# Altium project LM-003.PrjPcb (part 1 of 4)
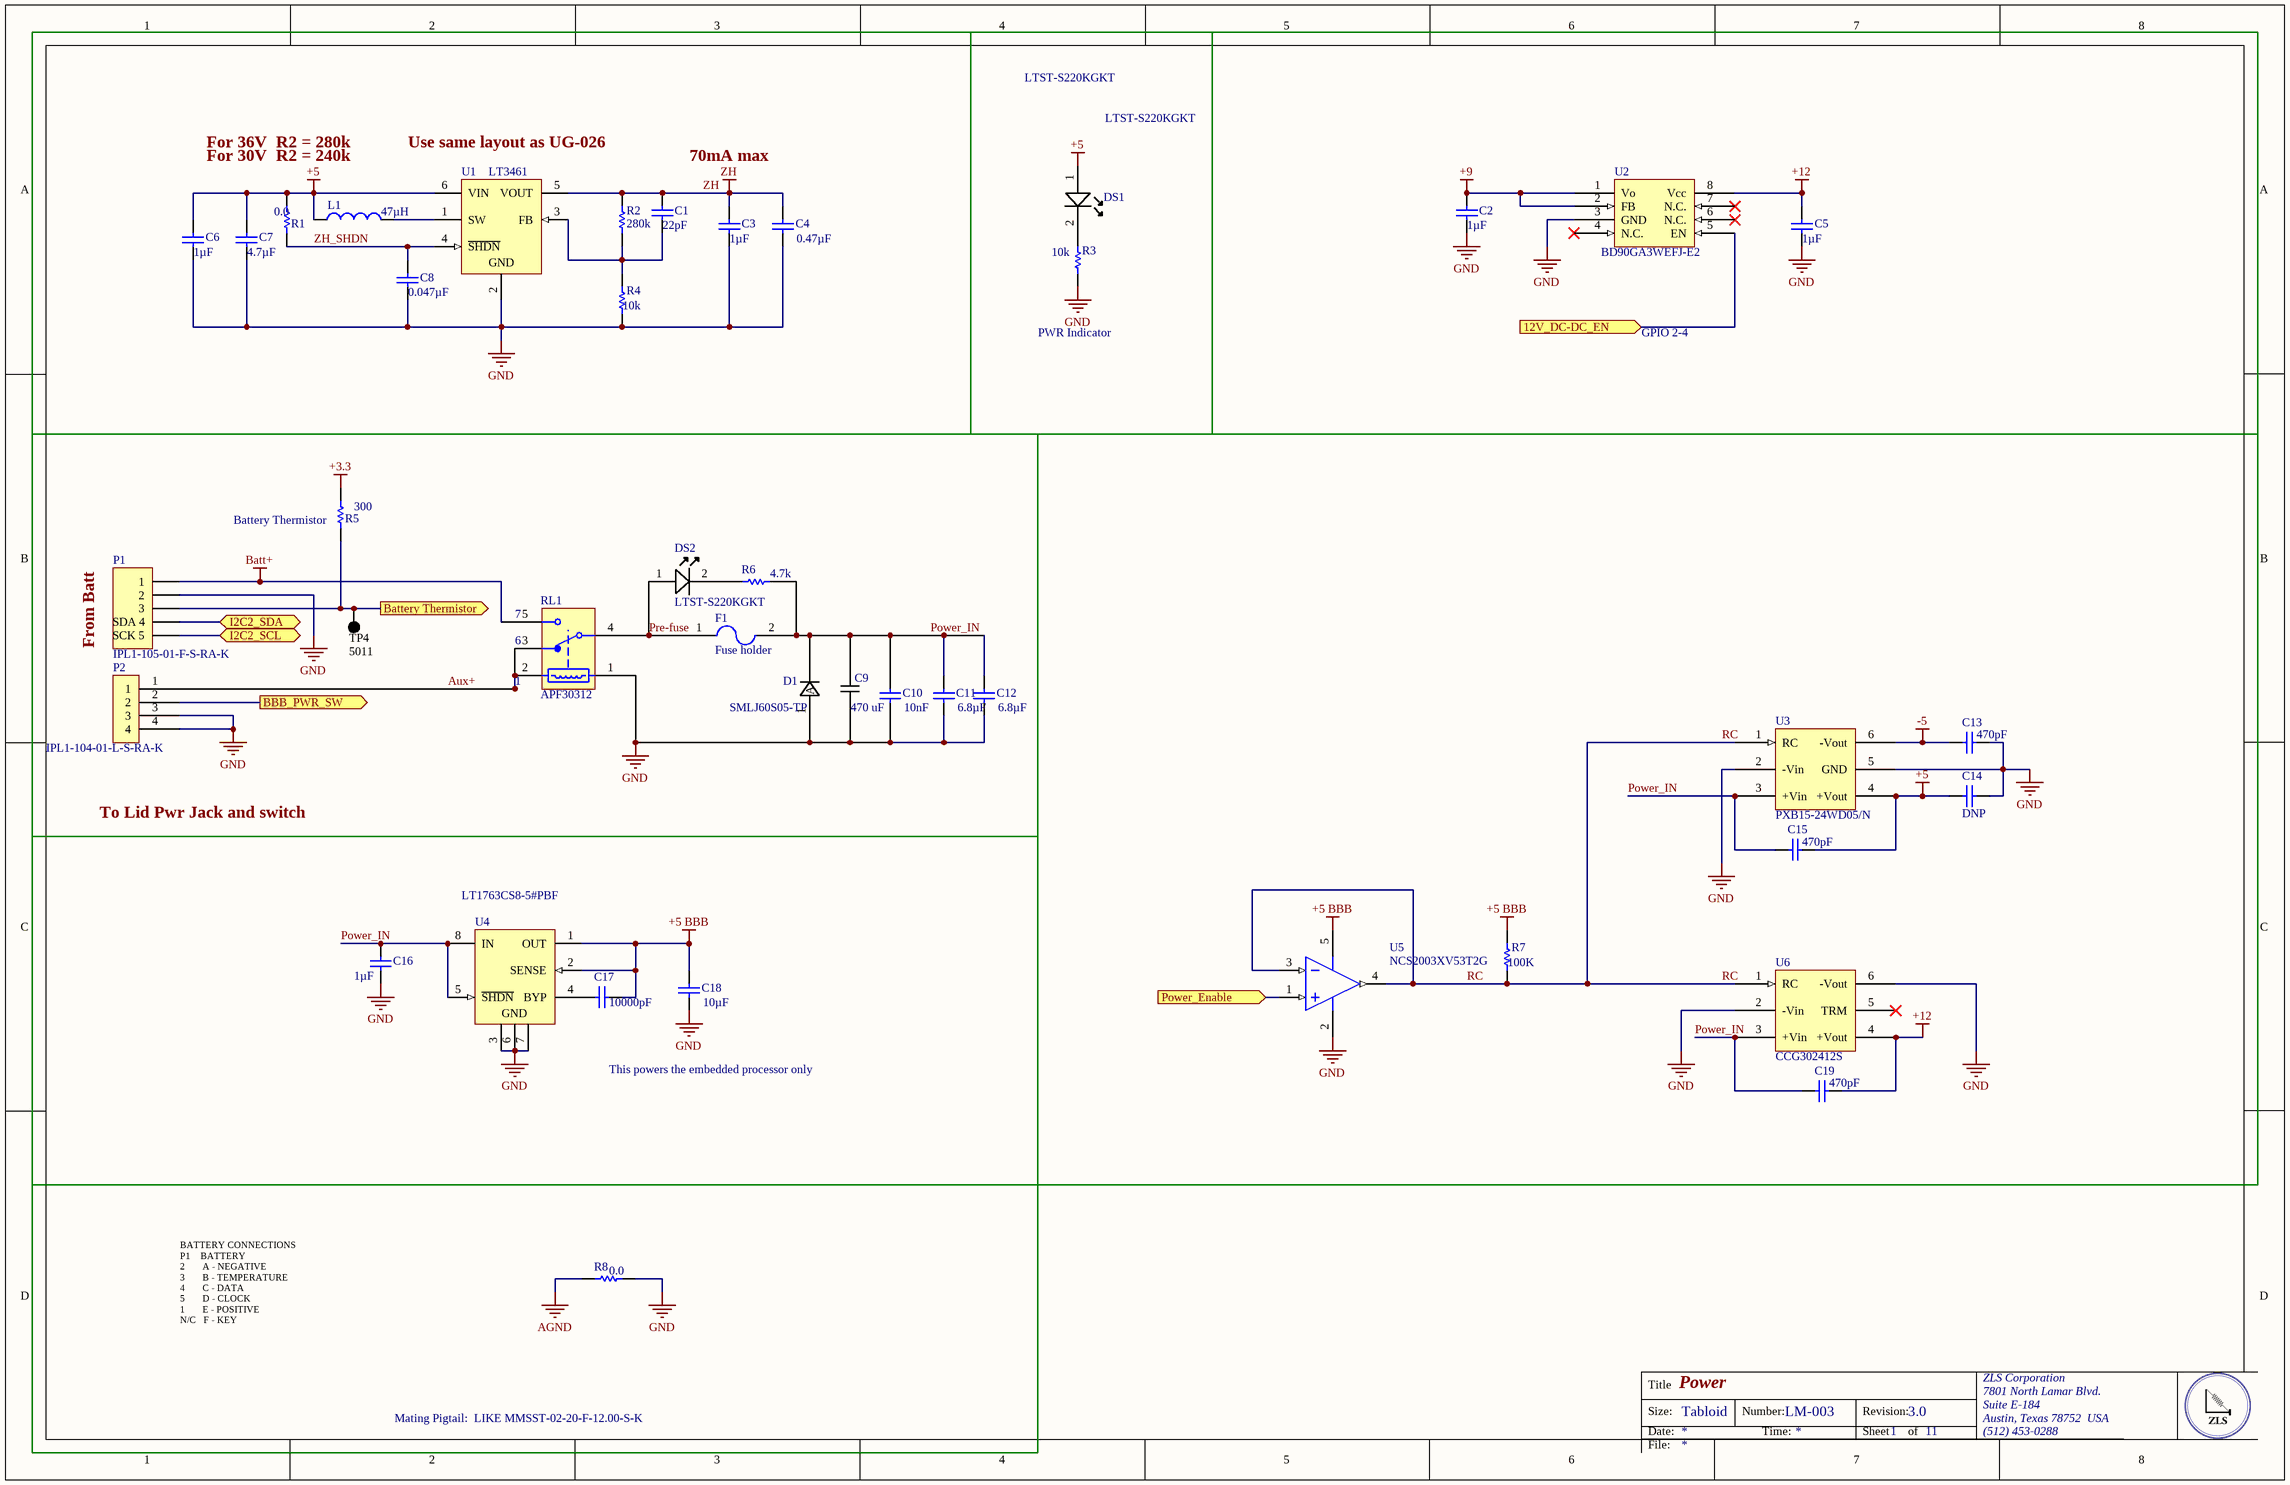
[diagram p0: Power.SchDoc]
9 sheets, 178 parts. Net scope: flat (ports and power ports of the same name join across sheets).
Board file: LM-003.PcbDoc
Sheets:
  Power.SchDoc
  FeedbackLoop.SchDoc
  ADC.SchDoc
  BBB Headers.SchDoc
  Connectors.SchDoc
  heater_control.SchDoc
  Power Monitor.SchDoc
  Real Time Clock.SchDoc
  RS232.SchDoc

## Sheet Power.SchDoc: Power
size Tabloid; DocumentNumber: LM-003; Revision: 3.0; SheetNumber: 1; SheetTotal: 11

### Parts
C1  Capacitance: 22pF  [CAPC0603(1608)100_N]  (hidden comment: CAP CER 22PF 50V X7R 0603)
C2  Capacitance: 1µF  [CAPC1206(3216)130_N]  (hidden comment: CAP CER 1UF 50V X7R 1210)
C3  Capacitance: 1µF  [CAPC1210(3225)100_N]  (hidden comment: CAP CER 1UF 50V X7R 1210)
C4  Capacitance: 0.47µF  [CAPC1206(3216)190_N]  (hidden comment: CAP CER 0.47UF 50V X7R 1206)
C5  Capacitance: 1µF  [CAPC1206(3216)130_N]  (hidden comment: CAP CER 1UF 50V X7R 1210)
C6  Capacitance: 1µF  [CAPC0805(2012)145_N]  (hidden comment: CAP CER 1UF 16V X7R 0805)
C7  Capacitance: 4.7µF  [CAPC1206(3216)130_N]  (hidden comment: CAP CER 4.7UF 16V X7R 1206)
C8  Capacitance: 0.047µF  [CAPC0805(2012)145_N]  (hidden comment: CAP CER 0.047UF 16V X7R 0603)
C9  Capacitance: 470 uF  [RAD-0.1]  (hidden comment: Aluminum Electrolytic Capacitors - Leaded 16V 470uF 20%)
C10  Capacitance: 10nF  [CAPC0805(2012)145_N]  (hidden comment: CAP CER 10000PF 50V X7R 0805)
C11  Capacitance: 6.8µF  [CAPC1210(3225)100_L]  (hidden comment: CAP CER 6.8UF 50V X5R 1206)
C12  Capacitance: 6.8µF  [CAPC1210(3225)100_L]  (hidden comment: CAP CER 6.8UF 50V X5R 1206)
C13  Capacitance: 470pF  [CAPC1812(4532)230_M]  (hidden comment: CAP CER 470PF 3KV X7R 1812)
C14  DNP  [CAPC1812(4532)230_M]
C15  Capacitance: 470pF  [CAPC1812(4532)230_M]  (hidden comment: CAP CER 470PF 3KV X7R 1812)
C16  Capacitance: 1µF  [CAPC1210(3225)100_L]  (hidden comment: CAP CER 1UF 50V X7R 1210)
C17  Capacitance: 10000pF  [CAPC0805(2012)145_N]  (hidden comment: CAP CER 10000PF 25V X7R 0805)
C18  Capacitance: 10µF  [CAPC0805(2012)145_N]  (hidden comment: CAP CER 10UF 10V X7R 0805)
C19  Capacitance: 470pF  [CAPC1812(4532)230_M]  (hidden comment: CAP CER 470PF 3KV X7R 1812)
D1  Manufacturer Part Number: SMLJ60S05-TP  [DO-214AB]  (hidden comment: DIODE GEN PURP 50V 6A DO214AB)
DS1  Manufacturer Part Number: LTST-S220KGKT  [0805C_L]  (hidden comment: Lite-On LTST-S220KGKT Green LED, 571 nm 2012 (0805) Side View, Rectangle Lens SMD package)
DS2  Manufacturer Part Number: LTST-S220KGKT  [0805C_L]  (hidden comment: Lite-On LTST-S220KGKT Green LED, 571 nm 2012 (0805) Side View, Rectangle Lens SMD package)
F1  Fuse holder  [01530007Z]
L1  Inductance: 47µH  [0402-A]  (hidden comment: FIXED IND 47UH 170MA 1.3 OHM SMD)
P1  IPL1-105-01-F-S-RA-K  [IPL1-105-1]
P2  IPL1-104-01-L-S-RA-K  [IPL1-104-01]
R1  Resistance (Ohms): 0.0  [RESC0805(2012)_M]  (hidden comment: RES SMD 0.0 OHM JUMPER 1/8W 0805)
R2  Resistance (Ohms): 280k  [RESC0805(2012)_M]  (hidden comment: RES SMD 280K OHM 1% 1/8W 0805)
R3  Resistance (Ohms): 10k  [RESC0805(2012)_M]  (hidden comment: RES SMD 10K OHM 1% 1/8W 0805)
R4  Resistance (Ohms): 10k  [RESC0805(2012)_M]  (hidden comment: RES SMD 10K OHM 1% 1/8W 0805)
R5  Resistance (Ohms): 300  [RESC0805(2012)_M]  (hidden comment: 300K 5% 0805(2012))
R6  Resistance (Ohms): 4.7k  [RESC0805(2012)_M]  (hidden comment: RES SMD 4.7K OHM 1% 1/8W 0805)
R7  Resistance: 100K  [RESC0805(2012)_M]  (hidden comment: RES SMD 100K OHM 1% 1/8W 0805)
R8  Resistance (Ohms): 0.0  [RESC0805(2012)_M]  (hidden comment: RES SMD 0.0 OHM JUMPER 1/8W 0805)
RL1  APF30312  [PNSC-PF-5-2800x500x1500_V]
TP4  5011  [KSTN-5011_V]
U1  LT3461  [LT-S6-6-TSOT-23_N]
U2  BD90GA3WEFJ-E2  [TSOP127P600X100-8N]
U3  PXB15-24WD05/N  [PXB15-24WD05/N]
U4  LT1763CS8-5#PBF  [LT-S8-8_M]
U5  NCS2003XV53T2G  [ONSC-SOT-553-5-463B_V]
U6  CCG302412S  [CCG30]

### Blocks framed on the sheet
GPIO 2-4: C2 C5 U2
From Batt: C9-C12 D1 DS2 F1 P1 P2 R5 R6 RL1 TP4
To Lid Pwr Jack and switch: C16-C18 U4
Mating Pigtail:  LIKE MMSST-02-20-F-12.00-S-K: R8

### Ports
12V_DC-DC_EN (in), Battery Thermistor (out), BBB_PWR_SW (out), I2C2_SCL, I2C2_SDA, Power_Enable (in)

### Nets
+3.3: R5.2
+5: C6.2 C7.2 C14.1 C15.2 DS1.1(A) L1.1 R1.1 U1.6(VIN) U3.4(+Vout)
+5 BBB: C17.1 C18.2 R7.1 U4.1(OUT) U4.2(SENSE) U5.5(VDD)
+9: C2.2 U2.1(Vo) U2.2(FB)
+12: C5.2 C19.2 U2.8(Vcc) U6.4(+Vout)
-5: C13.1 U3.6(-Vout)
AGND: R8.2
Batt+: P1.1 RL1.5(NO)
GND: C2.1 C3.1 C4.1 C5.1 C6.1 C7.1 C8.1 C9.2 C10.1 C11.1 C12.1 C13.2 C14.2 C16.1 C18.1 D1.1(A) P1.2 P2.3 P2.4 R3.1 R4.2 R8.1 RL1.1 U1.2(GND) U2.3(GND) U3.2(-Vin) U3.5(GND) U4.3(GND) U4.6(GND) U4.7(GND) U5.2(VSS) U6.2(-Vin) U6.6(-Vout)
ZH: C1.2 C3.2 C4.2 R2.1 U1.5(VOUT)
Aux+: P2.1 RL1.2 RL1.3(NC)
Power_IN: C9.1 C10.2 C11.2 C12.2 C15.1 C16.2 C19.1 D1.2(K) F1.2 R6.1 U3.3(+Vin) U4.5(~{SHDN}) U4.8(IN) U6.3(+Vin)
Pre-fuse: DS2.1(A) F1.1 RL1.4(COM)
RC: R7.2 U3.1(RC) U5.3(IN-) U5.4(OUT) U6.1(RC)
ZH_SHDN: C8.2 R1.2 U1.4(~{SHDN})
NetC1_1: C1.1 R2.2 R4.1 U1.3(FB)
NetC17_2: C17.2 U4.4(BYP)
NetDS1_2: DS1.2(K) R3.2
NetDS2_2: DS2.2(K) R6.2
NetL1_2: L1.2 U1.1(SW)
NetP1_3: P1.3 R5.1 TP4.1 ; port Battery Thermistor
NetP1_4: P1.4(SDA_4) ; port I2C2_SDA
NetP1_5: P1.5(SCK_5) ; port I2C2_SCL
NetP2_2: P2.2 ; port BBB_PWR_SW
NetU2_5: U2.5(EN) ; port 12V_DC-DC_EN
NetU5_1: U5.1(IN+) ; port Power_Enable

Not connected (* = marked no-connect by the designer): U2 4(N.C.)* 6(N.C.)* 7(N.C.)*; U6 5(TRM)*

### Notes on the sheet
- LTST-S220KGKT
- For 36V  R2 = 280k
- For 30V  R2 = 240k
- Use same layout as UG-026
- 70mA max
- PWR Indicator
- (near R5) Battery Thermistor
- (near RL1) 7
- (near RL1) 3
- (near RL1) 6
- (near RL1) 1
- (near RL1) 8
- This powers the embedded processor only
- BATTERY CONNECTIONS
  P1    BATTERY
  2       A - NEGATIVE
  3       B - TEMPERATURE
  4       C - DATA
  5       D - CLOCK
  1       E - POSITIVE
  N/C   F - KEY
- Title
- Size:
- Date:
- Tabloid
- Number:
- Time:
- Revision:
- Sheet
- of
- ZLS Corporation
- 7801 North Lamar Blvd.
- Suite E-184
- Austin, Texas 78752  USA
- (512) 453-0288
- File:

### Library data of the parts
C1 = CMP-1035-00578-1: Manufacturer: AVX Corporation; Manufacturer Part Number: 06035C220JAT2A; Tolerance: ±5%; Supplier 1: Digi-Key; Supplier Part Number 1: 478-6204-6-ND; RoHS: RoHS Compliant; Category: Capacitors; Stock 1: 72942; Pricing 1: 1=0.2, 10=0.136, 100=0.0688, 1000=0.04166 (USD); Packaging: Digi-Reel®; Part Status: Active; Voltage - Rated: 50V; Temperature Coefficient: X7R; Operating Temperature: -55°C ~ 125°C; Features: -; Ratings: -; Applications: General Purpose; Mounting Type: Surface Mount, MLCC; Package / Case: 0603 (1608 Metric); Size / Dimension: 0.063" L x 0.032" W (1.60mm x 0.81mm); Height - Seated (Max): -; Thickness (Max): 0.035" (0.90mm); Lead Spacing: -; Lead Style: -; ComponentLink1URL: http://datasheets.avx.com/X7RDielectric.pdf; ComponentLink1Description: http://datasheets.avx.com/X7RDielectric.pdf
C2 C5 = CMP-1037-04913-1: Manufacturer: Murata Electronics North America; Manufacturer Part Number: GRM32RR71H105KA01L; Tolerance: ±10%; Supplier 1: Digi-Key; Supplier Part Number 1: 490-1863-6-ND; RoHS: RoHS Compliant; Category: Capacitors; Stock 1: 66890; Pricing 1: 1=0.35, 10=0.242, 100=0.1449, 500=0.10868 (USD); Packaging: Digi-Reel®; Part Status: Active; Voltage - Rated: 50V; Temperature Coefficient: X7R; Operating Temperature: -55°C ~ 125°C; Features: -; Ratings: -; Applications: General Purpose; Mounting Type: Surface Mount, MLCC; Package / Case: 1210 (3225 Metric); Size / Dimension: 0.126" L x 0.098" W (3.20mm x 2.50mm); Height - Seated (Max): -; Thickness (Max): 0.079" (2.00mm); Lead Spacing: -; Lead Style: -; ComponentLink1URL: http://search.murata.co.jp/Ceramy/image/img/A01X/G101/ENG/GRM32RR71H105KA01-01.pdf; ComponentLink1Description: http://search.murata.co.jp/Ceramy/image/img/A01X/G101/ENG/GRM32RR71H105KA01-01.pdf
C3 = CMP-1038-01123-1: Manufacturer: Taiyo Yuden; Manufacturer Part Number: UMK325B7105KH-T; Tolerance: ±10%; Supplier 1: Digi-Key; Supplier Part Number 1: 587-1366-1-ND; RoHS: RoHS Compliant; Category: Capacitors; Stock 1: 23864; Pricing 1: 1=0.36, 10=0.247, 100=0.1398, 500=0.0987, 1000=0.08637 (USD); Packaging: Cut Tape (CT); Part Status: Active; Voltage - Rated: 50V; Temperature Coefficient: X7R; Operating Temperature: -55°C ~ 125°C; Features: -; Ratings: -; Applications: General Purpose; Mounting Type: Surface Mount, MLCC; Package / Case: 1210 (3225 Metric); Size / Dimension: 0.126" L x 0.098" W (3.20mm x 2.50mm); Height - Seated (Max): -; Thickness (Max): 0.063" (1.60mm); Lead Spacing: -; Lead Style: -; ComponentLink1URL: http://www.yuden.co.jp/productdata/catalog/en/mlcc_all_e.pdf; ComponentLink1Description: http://www.yuden.co.jp/productdata/catalog/en/mlcc_all_e.pdf
C4 = CMP-1037-04570-1: Manufacturer: Taiyo Yuden; Manufacturer Part Number: UMK316B7474KL-T; Tolerance: ±10%; Supplier 1: Digi-Key; Supplier Part Number 1: 587-1325-1-ND; RoHS: RoHS Compliant; Category: Capacitors; Stock 1: 8658; Pricing 1: 1=0.3, 10=0.203, 100=0.115, 500=0.08114, 1000=0.071 (USD); Packaging: Cut Tape (CT); Part Status: Active; Voltage - Rated: 50V; Temperature Coefficient: X7R; Operating Temperature: -55°C ~ 125°C; Features: -; Ratings: -; Applications: General Purpose; Mounting Type: Surface Mount, MLCC; Package / Case: 1206 (3216 Metric); Size / Dimension: 0.126" L x 0.063" W (3.20mm x 1.60mm); Height - Seated (Max): -; Thickness (Max): 0.071" (1.80mm); Lead Spacing: -; Lead Style: -; ComponentLink1URL: http://www.yuden.co.jp/productdata/catalog/en/mlcc_all_e.pdf; ComponentLink1Description: http://www.yuden.co.jp/productdata/catalog/en/mlcc_all_e.pdf
C6 = CMP-1036-04795-1: Manufacturer: Taiyo Yuden; Manufacturer Part Number: EMK212B7105KG-T; Tolerance: ±10%; Supplier 1: Digi-Key; Supplier Part Number 1: 587-1283-1-ND; RoHS: RoHS Compliant; Category: Capacitors; Stock 1: 41495; Pricing 1: 1=0.13, 10=0.089, 100=0.042, 1000=0.02439 (USD); Packaging: Cut Tape (CT); Part Status: Active; Voltage - Rated: 16V; Temperature Coefficient: X7R; Operating Temperature: -55°C ~ 125°C; Features: -; Ratings: -; Applications: General Purpose; Mounting Type: Surface Mount, MLCC; Package / Case: 0805 (2012 Metric); Size / Dimension: 0.079" L x 0.049" W (2.00mm x 1.25mm); Height - Seated (Max): -; Thickness (Max): 0.053" (1.35mm); Lead Spacing: -; Lead Style: -; ComponentLink1URL: http://ds.yuden.co.jp/TYCOMPAS/ut/detail.do?productNo=EMK212B7105KG-T&fileName=EMK212B7105KG-T_SS&mode=specSheetDownload; ComponentLink1Description: http://ds.yuden.co.jp/TYCOMPAS/ut/detail.do?productNo=EMK212B7105KG-T&fileName=EMK212B7105KG-T_SS&mode=specSheetDownload
C7 = CMP-1037-04913-1: Manufacturer: Taiyo Yuden; Manufacturer Part Number: EMK316B7475KL-T; Tolerance: ±10%; Supplier 1: Digi-Key; Supplier Part Number 1: 587-1331-6-ND; RoHS: RoHS Compliant; Category: Capacitors; Stock 1: 59490; Pricing 1: 1=0.25, 10=0.17, 100=0.0965, 1000=0.0596 (USD); Packaging: Digi-Reel®; Part Status: Active; Voltage - Rated: 16V; Temperature Coefficient: X7R; Operating Temperature: -55°C ~ 125°C; Features: -; Ratings: -; Applications: General Purpose; Mounting Type: Surface Mount, MLCC; Package / Case: 1206 (3216 Metric); Size / Dimension: 0.126" L x 0.063" W (3.20mm x 1.60mm); Height - Seated (Max): -; Thickness (Max): 0.071" (1.80mm); Lead Spacing: -; Lead Style: -; ComponentLink1URL: http://ds.yuden.co.jp/TYCOMPAS/ut/detail.do?productNo=EMK316B7475KL-T&fileName=EMK316B7475KL-T_SS&mode=specSheetDownload; ComponentLink1Description: http://ds.yuden.co.jp/TYCOMPAS/ut/detail.do?productNo=EMK316B7475KL-T&fileName=EMK316B7475KL-T_SS&mode=specSheetDownload
C8 = CMP-1036-04795-1: Manufacturer: Murata Electronics North America; Manufacturer Part Number: GRM188R71C473KA01D; Tolerance: ±10%; Supplier 1: Digi-Key; Supplier Part Number 1: 490-1529-6-ND; RoHS: RoHS Compliant; Category: Capacitors; Stock 1: 26; Pricing 1: 1=0.1, 10=0.046, 100=0.0206, 500=0.0147, 1000=0.01155 (USD); Packaging: Digi-Reel®; Part Status: Active; Voltage - Rated: 16V; Temperature Coefficient: X7R; Operating Temperature: -55°C ~ 125°C; Features: -; Ratings: -; Applications: General Purpose; Mounting Type: Surface Mount, MLCC; Package / Case: 0603 (1608 Metric); Size / Dimension: 0.063" L x 0.031" W (1.60mm x 0.80mm); Height - Seated (Max): -; Thickness (Max): 0.035" (0.90mm); Lead Spacing: -; Lead Style: -; ComponentLink1URL: http://www.murata.com/~/media/webrenewal/support/library/catalog/products/capacitor/mlcc/c02e.ashx; ComponentLink1Description: http://www.murata.com/~/media/webrenewal/support/library/catalog/products/capacitor/mlcc/c02e.ashx
C9 = CAP B: Manufacturer 1: Lelon; Manufacturer Part Number 1: TEA471M1CBK-0816P; Case Diameter: 8 mm; Case Length: 16 mm; Dissipation Factor DF: 0.17; Load Life: 2000 h; Ripple Current: 460 mA; Product Status: Factory Special Order; Supplier 1: Mouser; Supplier Part Number 1: 140-TEA471M1CBK0816P; RoHS 1: RoHS Compliant; Description 1: Aluminum Electrolytic Capacitors - Leaded 16V 470uF 20%; Category 1: Aluminum Electrolytic Capacitors - Leaded; Stock 1: 0; Dimensions: 8 mm Dia. x 16 mm L; Product: General Purpose Electrolytic Capacitors; Series: TEA; Termination Style: Axial; Tolerance: 20 %; Voltage Rating DC: 16 V; Brand: Lelon; Maximum Operating Temperature: + 85 C; Product Category: Axial Electrolytic Capacitors; Standard Pack Qty: 500; RoHS - Mouser: Y; Minimum Order Quantity: 2000; Reeling: False; ComponentLink1URL: http://www.mouser.com/catalog/specsheets/ea.pdf; ComponentLink1Description: http://www.mouser.com/catalog/specsheets/ea.pdf
C10 = CMP-1036-04795-1: Manufacturer: Kemet; Manufacturer Part Number: C0805F103K5RACTU; Dielectric Material: Ceramic; Tolerance: 10%; Supplier 1: Digi-Key; Supplier Part Number 1: 399-5107-6-ND; Stock 1: 29640; Pricing 1: 1=0.29, 10=0.202, 100=0.1146, 500=0.0809, 1000=0.0708 (USD); Mount: Surface Mount; Case/Package: 0805; Number of Pins: 2; Case Code (Imperial): 0805; Case Code (Metric): 2012; Min Operating Temperature: -55°C; Max Operating Temperature: 125°C; Package Quantity: 4000; Voltage Rating: 50V; Voltage Rating (DC): 50V; Packaging: Cut Tape; Dielectric: X7R; Termination: SMD/SMT; Voltage: 50V; Length: 2mm; Height: 0.9mm; Width: 1.25mm; Thickness: 0.039inch; Depth: 1.25mm; Lead Pitch: 0.75mm; REACH SVHC: No SVHC; ComponentLink1URL: https://datasheet.ciiva.com/146/docfinderpartnumber-c0805f103k5ractu-146278.pdf; ComponentLink1Description: https://datasheet.ciiva.com/146/docfinderpartnumber-c0805f103k5ractu-146278.pdf; ComponentLink2URL: https://datasheet.ciiva.com/7842/48829-7842407.pdf; ComponentLink2Description: https://datasheet.ciiva.com/7842/48829-7842407.pdf; ComponentLink3URL: https://datasheet.ciiva.com/7842/48829-7842408.pdf; ComponentLink3Description: https://datasheet.ciiva.com/7842/48829-7842408.pdf
C11 C12 = CMP-1038-00632-1: Manufacturer: TDK Corporation; Manufacturer Part Number: C3216X5R1H685K160AB; Tolerance: ±10%; Supplier 1: Digi-Key; Supplier Part Number 1: 445-5996-6-ND; RoHS: RoHS Compliant; Category: Capacitors; Stock 1: 29817; Pricing 1: 1=1.03, 10=0.785, 100=0.5615, 500=0.4347, 1000=0.37433 (USD); Packaging: Digi-Reel®; Part Status: Active; Voltage - Rated: 50V; Temperature Coefficient: X5R; Operating Temperature: -55°C ~ 85°C; Features: Low ESL; Ratings: -; Applications: General Purpose; Failure Rate: -; Mounting Type: Surface Mount, MLCC; Package / Case: 1206 (3216 Metric); Size / Dimension: 0.126" L x 0.063" W (3.20mm x 1.60mm); Height - Seated (Max): -; Thickness (Max): 0.071" (1.80mm); Lead Spacing: -; Lead Style: -; ComponentLink1URL: https://product.tdk.com/info/en/catalog/datasheets/mlcc_commercial_general_en.pdf; ComponentLink1Description: https://product.tdk.com/info/en/catalog/datasheets/mlcc_commercial_general_en.pdf
C13 C15 C19 = CMP-1040-00561-1: Manufacturer: Kemet; Manufacturer Part Number: C1812C471KHRACTU; Tolerance: 10%; Supplier 1: Digi-Key; Supplier Part Number 1: 399-7289-6-ND; Stock 1: 2705; Pricing 1: 1=0.88, 10=0.666, 100=0.4761 (USD); Case/Package: 1812; Case Code (Metric): 4532; Case Code (Imperial): 1812; Min Operating Temperature: -55°C; Max Operating Temperature: 125°C; Voltage Rating: 3kV; Packaging: Tape and Reel; Package Quantity: 1; Voltage Rating (DC): 3kV; Length: 0.177inch; Width: 0.126inch; Thickness: 0.071inch; Lead Free: Lead Free; ComponentLink1URL: http://www.kemet.com/docfinder?Partnumber=C1812C471KHRACTU; ComponentLink1Description: http://www.kemet.com/docfinder?Partnumber=C1812C471KHRACTU
C14 = CMP-1040-00561-1: CAP CER 470PF 3KV X7R 1812; Manufacturer: Kemet; Manufacturer Part Number: C1812C471KHRACTU; Tolerance: 10%; Supplier 1: Digi-Key; Supplier Part Number 1: 399-7289-6-ND; Stock 1: 2705; Pricing 1: 1=0.88, 10=0.666, 100=0.4761 (USD); Case/Package: 1812; Case Code (Metric): 4532; Case Code (Imperial): 1812; Min Operating Temperature: -55°C; Max Operating Temperature: 125°C; Capacitance: 470pF; Voltage Rating: 3kV; Packaging: Tape and Reel; Package Quantity: 1; Voltage Rating (DC): 3kV; Length: 0.177inch; Width: 0.126inch; Thickness: 0.071inch; Lead Free: Lead Free; ComponentLink1URL: http://www.kemet.com/docfinder?Partnumber=C1812C471KHRACTU; ComponentLink1Description: http://www.kemet.com/docfinder?Partnumber=C1812C471KHRACTU
C16 = CMP-1038-00632-1: Manufacturer: Murata Electronics North America; Manufacturer Part Number: GRM32RR71H105KA01L; Tolerance: ±10%; Supplier 1: Digi-Key; Supplier Part Number 1: 490-1863-6-ND; RoHS: RoHS Compliant; Category: Capacitors; Stock 1: 66890; Pricing 1: 1=0.35, 10=0.242, 100=0.1449, 500=0.10868 (USD); Packaging: Digi-Reel®; Part Status: Active; Voltage - Rated: 50V; Temperature Coefficient: X7R; Operating Temperature: -55°C ~ 125°C; Features: -; Ratings: -; Applications: General Purpose; Mounting Type: Surface Mount, MLCC; Package / Case: 1210 (3225 Metric); Size / Dimension: 0.126" L x 0.098" W (3.20mm x 2.50mm); Height - Seated (Max): -; Thickness (Max): 0.079" (2.00mm); Lead Spacing: -; Lead Style: -; ComponentLink1URL: http://search.murata.co.jp/Ceramy/image/img/A01X/G101/ENG/GRM32RR71H105KA01-01.pdf; ComponentLink1Description: http://search.murata.co.jp/Ceramy/image/img/A01X/G101/ENG/GRM32RR71H105KA01-01.pdf
C17 = CMP-1036-04795-1: Manufacturer: Murata Electronics North America; Manufacturer Part Number: GRM216R71E103KA01D; Tolerance: ±10%; Supplier 1: Digi-Key; Supplier Part Number 1: 490-12748-6-ND; RoHS: RoHS Compliant; Category: Capacitors; Stock 1: 13127; Pricing 1: 1=0.11, 10=0.077, 100=0.0343, 500=0.02452, 1000=0.01926 (USD); Packaging: Digi-Reel®; Part Status: Active; Voltage - Rated: 25V; Temperature Coefficient: X7R; Operating Temperature: -55°C ~ 125°C; Features: -; Ratings: -; Applications: General Purpose; Mounting Type: Surface Mount, MLCC; Package / Case: 0805 (2012 Metric); Size / Dimension: 0.079" L x 0.049" W (2.00mm x 1.25mm); Height - Seated (Max): -; Thickness (Max): 0.028" (0.70mm); Lead Spacing: -; Lead Style: -; ComponentLink1URL: http://www.murata.com/~/media/webrenewal/support/library/catalog/products/capacitor/mlcc/c02e.ashx; ComponentLink1Description: http://www.murata.com/~/media/webrenewal/support/library/catalog/products/capacitor/mlcc/c02e.ashx
C18 = CMP-1036-04795-1: Manufacturer: Murata Electronics North America; Manufacturer Part Number: GCM21BR71A106KE22L; Tolerance: ±10%; Supplier 1: Digi-Key; Supplier Part Number 1: 490-10674-6-ND; RoHS: RoHS Compliant; Category: Capacitors; Stock 1: 136726; Pricing 1: 1=0.49, 10=0.347, 100=0.2282, 500=0.16906, 1000=0.14369 (USD); Packaging: Digi-Reel®; Part Status: Active; Voltage - Rated: 10V; Temperature Coefficient: X7R; Operating Temperature: -55°C ~ 125°C; Features: -; Ratings: AEC-Q200; Applications: Automotive; Mounting Type: Surface Mount, MLCC; Package / Case: 0805 (2012 Metric); Size / Dimension: 0.079" L x 0.049" W (2.00mm x 1.25mm); Height - Seated (Max): -; Thickness (Max): 0.055" (1.40mm); Lead Spacing: -; Lead Style: -; ComponentLink1URL: http://search.murata.co.jp/Ceramy/image/img/A01X/G101/ENG/GCM21BR71A106KE22-01.pdf; ComponentLink1Description: http://search.murata.co.jp/Ceramy/image/img/A01X/G101/ENG/GCM21BR71A106KE22-01.pdf
D1 = DIODE A/K A: Manufacturer 1: ON Semiconductor; Manufacturer: Micro Commercial Co; Description 1: DIODE GP 50V 6A MICRODE BUTTON; Category 1: Discrete Semiconductor Products; Diode Type: Standard; Current - Reverse Leakage @ Vr: 25µA @ 50V; Voltage - Forward (Vf) (Max) @ If: 1V @ 6A; Speed: Standard Recovery >500ns, > 200mA (Io); Current - Average Rectified (Io): 6A; Capacitance @ Vr, F: -; ComponentLink1URL: http://www.onsemi.com/pub_link/Collateral/MR750-D.PDF; ComponentLink1Description: http://www.onsemi.com/pub_link/Collateral/MR750-D.PDF; Supplier 1: Digi-Key; Supplier Part Number 1: SMLJ60S05-TPMSCT-ND; RoHS: RoHS Compliant; Category: Discrete Semiconductor Products; Stock 1: 6086; Pricing 1: 1=1.06, 10=0.939, 25=0.848, 100=0.7419, 250=0.65108, 500=0.57536, 1000=0.45423 (USD); Packaging: Cut Tape (CT); Part Status: Active; Voltage - DC Reverse (Vr) (Max): 50V; Mounting Type: Surface Mount; Package / Case: DO-214AB, SMC; Supplier Device Package: DO-214AB, (SMC); Operating Temperature - Junction: -55°C ~ 150°C; ComponentLink2URL: http://www.mccsemi.com/up_pdf/SMLJ60S05~SMLJ60S10(DO-214AB).pdf; ComponentLink2Description: http://www.mccsemi.com/up_pdf/SMLJ60S05~SMLJ60S10(DO-214AB).pdf
DS1 DS2 = LED A/K: Manufacturer: Vishay / Lite-On; Lens Colour: Colorless; Viewing Angle: 130°; Luminous Intensity: 35mcd; Forward Current: 20mA; Forward Voltage: 2V; Lens Style: Diffused,Colorless; Power Rating: 75mW; Dominant Wavelength: 568nm; Lens Transparency: Clear; Number of Elements: 1; Power Dissipation: 75W; Wavelength: 574nm; Supplier 1: Digi-Key; Supplier Part Number 1: 160-1468-1-ND; Stock 1: 74800; Pricing 1: 1=0.29, 10=0.212, 25=0.1564, 100=0.1117, 250=0.0759, 500=0.067, 1000=0.0525 (USD); Mount: Surface Mount; Case/Package: 0805; Number of Pins: 2; Colour: Green; Case Code (Metric): 2012; Case Code (Imperial): 0805; Min Operating Temperature: -55°C; Max Operating Temperature: 85°C; Packaging: Tape and Reel; Package Quantity: 4000; Illumination Colour: Green; Test Current: 20mA; Number of LEDs: 1; Length: 2.1mm; Height: 0.6mm; Width: 1mm; Depth: 0.6mm; Radiation Hardening: No; Lead Free: Lead Free; ComponentLink1URL: https://datasheet.ciiva.com/11775/0900766b80dc0b70-11775441.pdf; ComponentLink1Description: https://datasheet.ciiva.com/11775/0900766b80dc0b70-11775441.pdf; ComponentLink2URL: https://datasheet.ciiva.com/2110/s-110-ltst-s220kgkt-2110069.pdf; ComponentLink2Description: https://datasheet.ciiva.com/2110/s-110-ltst-s220kgkt-2110069.pdf; ComponentLink3URL: https://datasheet.ciiva.com/2110/s-110-ltst-s220kgkt-2110070.pdf; ComponentLink3Description: https://datasheet.ciiva.com/2110/s-110-ltst-s220kgkt-2110070.pdf; ComponentLink4URL: https://datasheet.ciiva.com/12400/100-ltst-s220kgkt-59602-12400886.pdf; ComponentLink4Description: https://datasheet.ciiva.com/12400/100-ltst-s220kgkt-59602-12400886.pdf; ComponentLink5URL: https://datasheet.ciiva.com/2110/s-110-ltst-s220kgkt-2110071.pdf; ComponentLink5Description: https://datasheet.ciiva.com/2110/s-110-ltst-s220kgkt-2110071.pdf; ComponentLink6URL: https://datasheet.ciiva.com/16379/ltst-s220kgkt-16379082.pdf; ComponentLink6Description: https://datasheet.ciiva.com/16379/ltst-s220kgkt-16379082.pdf
  DS2: Supplier 2: Farnell; Supplier Part Number 2: 2062310; RoHS: YES; Stock 2: 2271; Pricing 2: 1=0.325, 10=0.317, 100=0.23, 200=0.228, 400=0.182, 900=0.147, 3000=0.114, 9000=0.107 (GBP); ComponentLink7URL: http://www.farnell.com/cad/2124774.pdf; ComponentLink7Description: http://www.farnell.com/cad/2124774.pdf; ComponentLink8URL: http://www.farnell.com/datasheets/693084.pdf; ComponentLink8Description: http://www.farnell.com/datasheets/693084.pdf
F1 = Fuse 2: FUSE HOLDER BLADE 32V 15A PCB; Manufacturer 1: Littelfuse Inc.; Category 1: Circuit Protection; For Use With/Related Products: MINI ATC, MINI ATO; Fuse Size: 0.43" L x 0.15" W x 0.64" H (10.92mm x 3.81mm x 16.25mm); Number of Circuits: 1; Supplier 1: Digi-Key; Supplier Part Number 1: F064-ND; Manufacturer Part Number 1: 01530007Z; RoHS 1: RoHS Compliant; Description 1: FUSE HOLDER BLADE 32V 15A PCB; Stock 1: 4234; Pricing 1: 1=3.45, 5=3.336, 10=3.22, 50=2.53, 100=2.07, 250=2.01252, 500=1.725, 1000=1.61, 5000=1.4375 (USD); Part Status: Active; Fuseholder Type: Holder; Fuse Type: Blade; Voltage: 32V; Current Rating: 15A; Mounting Type: PCB; Orientation: Horizontal; Termination Style: PC Pin; Contact Material: Copper Alloy; Contact Finish: Tin; ComponentLink1URL: http://www.littelfuse.com/~/media/commercial-vehicle/datasheets/automotive-fuse-holders/mini/littelfuse_fuse-holders-mini-153-pc-datasheet.pdf; ComponentLink1Description: http://www.littelfuse.com/~/media/commercial-vehicle/datasheets/automotive-fuse-holders/mini/littelfuse_fuse-holders-mini-153-pc-datasheet.pdf
L1 = Inductor: Manufacturer 1: Murata Electronics North America; Manufacturer Part Number 1: LQH32CN470K23L; Category 1: Inductors, Coils, Chokes; Type: Wirewound; Material - Core: Ferrite; Tolerance: ±10%; Shielding: Unshielded; DC Resistance (DCR): 1.3 Ohm; Frequency - Self Resonant: 15MHz; Frequency - Test: 1MHz; Supplier 1: Digi-Key; Supplier Part Number 1: 490-2497-1-ND; RoHS 1: RoHS Compliant; Description 1: FIXED IND 47UH 170MA 1.3 OHM SMD; Stock 1: 39785; Pricing 1: 1=0.32, 10=0.291, 25=0.2584, 50=0.2262, 100=0.21, 250=0.1938, 500=0.18412, 750=0.16796, 1000=0.14858 (USD); Packaging: Cut Tape (CT); Current Rating: 170mA; Current - Saturation: -; Q @ Freq: -; Operating Temperature: -40°C ~ 85°C; Mounting Type: Surface Mount; Package / Case: 1210 (3225 Metric); Size / Dimension: 0.126" L x 0.098" W (3.20mm x 2.50mm); Height - Seated (Max): 0.067" (1.70mm); Supplier Device Package: 1210; ComponentLink1URL: http://search.murata.co.jp/Ceramy/image/img/PDF/ENG/L0075S0093LQH32C_23~33.pdf; ComponentLink1Description: http://search.murata.co.jp/Ceramy/image/img/PDF/ENG/L0075S0093LQH32C_23~33.pdf
P1 = Header 5H: Header, 5-Pin, Right Angle; Manufacturer 1: Samtec Inc.; Description 1: .100 TERMINAL ASSEMBLY; Category 1: Connectors, Interconnects; Pitch - Mating: 0.100" (2.54mm); Style: Board to Cable/Wire; Shrouding: Shrouded - 4 Wall; Number of Positions: 5; Number of Positions Loaded: All; Contact Length - Mating: 0.215" (5.46mm); Contact Length - Post: 0.085" (2.16mm); Material Flammability Rating: UL94 V-0; Voltage Rating: 675VAC, 954VDC; Supplier 1: Digi-Key; Supplier Part Number 1: IPL1-105-01-F-S-RA-K-ND; Manufacturer Part Number 1: IPL1-105-01-F-S-RA-K; RoHS 1: RoHS Compliant; Stock 1: 0; Pricing 1: 1=2.46 (USD); Packaging: Tube; Part Status: Active; Connector Type: Header; Contact Type: Male Pin; Number of Rows: 1; Row Spacing - Mating: -; Mounting Type: Through Hole, Right Angle; Termination: Solder; Fastening Type: Locking Ramp; Overall Contact Length: -; Insulation Height: 0.240" (6.10mm); Contact Shape: Square; Contact Finish - Mating: Gold; Contact Finish Thickness - Mating: 3µin (0.08µm); Contact Finish - Post: Tin; Contact Material: Phosphor Bronze; Insulation Material: Liquid Crystal Polymer (LCP); Features: -; Operating Temperature: -55°C ~ 125°C; Ingress Protection: -; Insulation Color: Natural; Current Rating: -; Mated Stacking Heights: -; Contact Finish Thickness - Post: -; Applications: -; ComponentLink1URL: http://suddendocs.samtec.com/prints/ipl1-1xx-xx-xxx-s-xx-x-xx-mkt.pdf; ComponentLink1Description: http://suddendocs.samtec.com/prints/ipl1-1xx-xx-xxx-s-xx-x-xx-mkt.pdf
P2 = 53047-0410: .100 TERMINAL ASSY; Manufacturer 1: Samtec Inc.; Category 1: Connectors, Interconnects; Connector Type: Header; Pitch - Mating: 0.100" (2.54mm); Style: Board to Cable/Wire; Shrouding: Shrouded - 4 Wall; Number of Positions: 4; Number of Positions Loaded: All; Contact Length - Mating: 0.215" (5.46mm); Contact Length - Post: 0.085" (2.16mm); Material Flammability Rating: UL94 V-0; Voltage Rating: 675VAC, 954VDC; Supplier 1: Digi-Key; Supplier Part Number 1: SAM9597-ND; Manufacturer Part Number 1: IPL1-104-01-L-S-RA-K; RoHS 1: RoHS Compliant; Description 1: .100 TERMINAL ASSY; Stock 1: 100; Pricing 1: 1=2.53, 10=2.424, 25=2.222, 50=2.121, 100=2.02, 250=1.76752, 500=1.717, 1000=1.4645, 2500=1.3635 (USD); Packaging: Tube; Part Status: Active; Contact Type: Male Pin; Number of Rows: 1; Row Spacing - Mating: -; Mounting Type: Through Hole, Right Angle; Termination: Solder; Fastening Type: Locking Ramp; Overall Contact Length: -; Insulation Height: 0.240" (6.10mm); Contact Shape: Square; Contact Finish - Mating: Gold; Contact Finish Thickness - Mating: 10µin (0.25µm); Contact Finish - Post: Tin; Contact Material: Phosphor Bronze; Insulation Material: Liquid Crystal Polymer (LCP); Features: -; Operating Temperature: -55°C ~ 125°C; Ingress Protection: -; Insulation Color: Natural; Current Rating: -; Mated Stacking Heights: -; Contact Finish Thickness - Post: -; Applications: -; ComponentLink1URL: http://suddendocs.samtec.com/prints/ipl1-1xx-xx-xxx-s-xx-x-xx-mkt.pdf; ComponentLink1Description: http://suddendocs.samtec.com/prints/ipl1-1xx-xx-xxx-s-xx-x-xx-mkt.pdf
R1 R8 = CMP-1013-00017-1: Manufacturer: Vishay Dale; Manufacturer Part Number: CRCW08050000Z0EA; Power (Watts): 0.125W, 1/8W; Supplier 1: Digi-Key; RoHS: RoHS Compliant; Category: Resistors; Pricing 1: 1=0.1, 10=0.026, 25=0.0184, 50=0.014, 100=0.0104, 250=0.00792, 500=0.00634, 1000=0.00466 (USD); Part Status: Active; Tolerance: Jumper; Composition: Thick Film; Features: Automotive AEC-Q200; Temperature Coefficient: -; Operating Temperature: -55°C ~ 155°C; Package / Case: 0805 (2012 Metric); Supplier Device Package: 0805; Size / Dimension: 0.079" L x 0.049" W (2.00mm x 1.25mm); Height - Seated (Max): 0.020" (0.50mm); Failure Rate: -; ComponentLink1URL: http://www.vishay.com/docs/20035/dcrcwe3.pdf; ComponentLink1Description: http://www.vishay.com/docs/20035/dcrcwe3.pdf
  R1: Supplier Part Number 1: 541-0.0ACT-ND; Stock 1: 117072; Packaging: Cut Tape (CT)
  R8: Supplier Part Number 1: 541-0.0ADKR-ND; Stock 1: 406953; Packaging: Digi-Reel®
R2 = CMP-1013-00017-1: Manufacturer: Vishay Dale; Manufacturer Part Number: CRCW0805280KFKEA; Power (Watts): 0.125W, 1/8W; Temperature Coefficient: ±100ppm/°C; Supplier 1: Digi-Key; Supplier Part Number 1: 541-280KCTR-ND; RoHS: RoHS Compliant; Category: Resistors; Stock 1: 10000; Pricing 1: 5000=0.00546, 10000=0.00474, 25000=0.00417, 50000=0.00382, 125000=0.00375 (USD); Packaging: Tape & Reel (TR); Part Status: Active; Tolerance: ±1%; Composition: Thick Film; Features: Automotive AEC-Q200; Operating Temperature: -55°C ~ 155°C; Package / Case: 0805 (2012 Metric); Supplier Device Package: 0805; Size / Dimension: 0.079" L x 0.049" W (2.00mm x 1.25mm); Height - Seated (Max): 0.020" (0.50mm); Failure Rate: -; ComponentLink1URL: http://www.vishay.com/docs/20035/dcrcwe3.pdf; ComponentLink1Description: http://www.vishay.com/docs/20035/dcrcwe3.pdf
R3 = CMP-1013-00017-1: Manufacturer: Vishay Dale; Manufacturer Part Number: CRCW080510K0FKTA; Power (Watts): 0.125W, 1/8W; Temperature Coefficient: ±100ppm/°C; Supplier 1: Digi-Key; Supplier Part Number 1: 541-3016-6-ND; RoHS: RoHS non-compliant; Category: Resistors; Stock 1: 5348; Pricing 1: 1=0.14, 10=0.129, 100=0.0496, 1000=0.02183, 2500=0.01885 (USD); Packaging: Digi-Reel®; Part Status: Active; Tolerance: ±1%; Composition: Thick Film; Features: Automotive AEC-Q200; Operating Temperature: -55°C ~ 155°C; Package / Case: 0805 (2012 Metric); Supplier Device Package: 0805; Size / Dimension: 0.079" L x 0.049" W (2.00mm x 1.25mm); Height - Seated (Max): 0.020" (0.50mm); Failure Rate: -; ComponentLink1URL: http://www.vishay.com/docs/20008/dcrcw.pdf; ComponentLink1Description: http://www.vishay.com/docs/20008/dcrcw.pdf
R4 = CMP-1013-00017-1: Manufacturer: Yageo; Manufacturer Part Number: RC0805FR-0710KL; Power (Watts): 0.125W, 1/8W; Temperature Coefficient: ±100ppm/°C; Supplier 1: Digi-Key; Supplier Part Number 1: 311-10.0KCRCT-ND; RoHS: RoHS Compliant; Category: Resistors; Stock 1: 13336570; Pricing 1: 1=0.1, 10=0.022, 100=0.0088, 1000=0.00396, 2500=0.00344 (USD); Packaging: Cut Tape (CT); Part Status: Active; Tolerance: ±1%; Composition: Thick Film; Features: Moisture Resistant; Operating Temperature: -55°C ~ 155°C; Package / Case: 0805 (2012 Metric); Supplier Device Package: 0805; Size / Dimension: 0.079" L x 0.049" W (2.00mm x 1.25mm); Height - Seated (Max): 0.024" (0.60mm); Failure Rate: -; ComponentLink1URL: http://www.yageo.com/documents/recent/PYu-RC_Group_51_RoHS_L_7.pdf; ComponentLink1Description: http://www.yageo.com/documents/recent/PYu-RC_Group_51_RoHS_L_7.pdf
R5 = CMP-1013-00133-1: 300K 0.125W 5% 0805 (2012 Metric)  SMD; Manufacturer: Vishay Dale; Manufacturer Part Number: CRCW0805300RFKEA; Tolerance: ±1%; Power (Watts): 0.125W, 1/8W; Temperature Coefficient: ±100ppm/°C; Supplier 1: Digi-Key; Supplier Part Number 1: 541-300CCT-ND; RoHS: RoHS Compliant; Category: Resistors; Stock 1: 79765; Pricing 1: 1=0.1, 10=0.044, 100=0.0178, 1000=0.00802, 2500=0.00696 (USD); Packaging: Cut Tape (CT); Part Status: Active; Composition: Thick Film; Features: Automotive AEC-Q200; Operating Temperature: -55°C ~ 155°C; Package / Case: 0805 (2012 Metric); Supplier Device Package: 0805; Size / Dimension: 0.079" L x 0.049" W (2.00mm x 1.25mm); Height - Seated (Max): 0.020" (0.50mm); Failure Rate: -; ComponentLink1URL: http://www.vishay.com/docs/20035/dcrcwe3.pdf; ComponentLink1Description: http://www.vishay.com/docs/20035/dcrcwe3.pdf
R6 = CMP-1013-00017-1: Manufacturer: Vishay Dale; Manufacturer Part Number: CRCW08054K70FKEA; Power (Watts): 0.125W, 1/8W; Temperature Coefficient: ±100ppm/°C; Supplier 1: Digi-Key; Supplier Part Number 1: 541-4.70KCDKR-ND; RoHS: RoHS Compliant; Category: Resistors; Stock 1: 0; Pricing 1: 1=0.1, 10=0.044, 100=0.0178, 1000=0.00802, 2500=0.00696 (USD); Packaging: Digi-Reel®; Part Status: Active; Tolerance: ±1%; Composition: Thick Film; Features: Automotive AEC-Q200; Operating Temperature: -55°C ~ 155°C; Package / Case: 0805 (2012 Metric); Supplier Device Package: 0805; Size / Dimension: 0.079" L x 0.049" W (2.00mm x 1.25mm); Height - Seated (Max): 0.020" (0.50mm); Failure Rate: -; ComponentLink1URL: http://www.vishay.com/docs/20035/dcrcwe3.pdf; ComponentLink1Description: http://www.vishay.com/docs/20035/dcrcwe3.pdf
R7 = CMP-1013-00017-1: Manufacturer: Vishay; Manufacturer Part Number: CRCW0805100KFKEA; Temperature Coefficient: 100ppm/°C; Power Rating: 125mW; Voltage Rating: 150V; Supplier 1: Avnet; Supplier Part Number 1: CRCW0805100KFKEA/BKN; Stock 1: 1317; Pricing 1: 1=0.1, 10=0.049, 25=0.042, 50=0.035, 100=0.028 (USD); Mount: Surface Mount; Case/Package: 0805; Number of Pins: 2; Weight: 0.000194oz; Contact Plating: Tin; Case Code (Imperial): 0805; Case Code (Metric): 2012; Min Operating Temperature: -55°C; Max Operating Temperature: 155°C; Tolerance: 1%; Composition: Thick Film; Termination: SMD/SMT; Packaging: Tape and Reel; Package Quantity: 5000; Military Standard: Not; Voltage Rating (DC): 150V; Length: 2mm; Height: 0.45mm; Width: 1.25mm; Depth: 1.25mm; Radiation Hardening: No; Lead Free: Lead Free; REACH SVHC: Unknown; ComponentLink1URL: https://datasheet.ciiva.com/11809/0900766b80d98b26-11809057.pdf; ComponentLink1Description: https://datasheet.ciiva.com/11809/0900766b80d98b26-11809057.pdf; ComponentLink2URL: https://datasheet.ciiva.com/7777/1697337-7777349.pdf; ComponentLink2Description: https://datasheet.ciiva.com/7777/1697337-7777349.pdf; ComponentLink3URL: https://datasheet.ciiva.com/3258/dcrcwe3-3258006.pdf; ComponentLink3Description: https://datasheet.ciiva.com/3258/dcrcwe3-3258006.pdf; ComponentLink4URL: https://datasheet.ciiva.com/16754/70201119-16754822.pdf; ComponentLink4Description: https://datasheet.ciiva.com/16754/70201119-16754822.pdf; ComponentLink5URL: https://datasheet.ciiva.com/8337/dcrcwe3-8337738.pdf; ComponentLink5Description: https://datasheet.ciiva.com/8337/dcrcwe3-8337738.pdf; ComponentLink6URL: https://datasheet.ciiva.com/16341/dcrcwe3-16341530.pdf; ComponentLink6Description: https://datasheet.ciiva.com/16341/dcrcwe3-16341530.pdf; ComponentLink7URL: https://datasheet.ciiva.com/16852/dcrcwe3-16852810.pdf; ComponentLink7Description: https://datasheet.ciiva.com/16852/dcrcwe3-16852810.pdf; ComponentLink8URL: https://datasheet.ciiva.com/16720/70201119-16720891.pdf; ComponentLink8Description: https://datasheet.ciiva.com/16720/70201119-16720891.pdf; ComponentLink9URL: https://datasheet.ciiva.com/7777/1720486-7777565.pdf; ComponentLink9Description: https://datasheet.ciiva.com/7777/1720486-7777565.pdf
RL1 = CMP-1503-00270-1: PF Relays, 12 V Coil Voltage, 170 mW Nominal Operating Power, -40 to 85 degC, 5-Pin PF, Tube, Case, RoHS; Manufacturer: Panasonic; Max Switching Voltage: 250 V AC; Nominal Operating Power: 170 mW; Electrical Life: 5x10^4 (N.O.), 3x10^4 (N.C.); Max Switching Current: 6 A; Coil Voltage: 12 V; Mechanical Life(Min.operation): 5x10^6; Pb-Free: True; ComponentLink3Description: Package Specification; ComponentLink1Description: Manufacturer URL; RoHS: True; ComponentLink3URL: http://www3.panasonic.biz/ac/e_download/control/relay/power/catalog/mech_eng_pf.pdf?f_cd=300412; PackageReference: PF-5-2800x500x1500; ComponentLink1URL: http://www3.panasonic.biz/ac/ae/index.jsp; ComponentLink2Description: Datasheet; Series: PF Relays; PartNumber: APF30312; PackageDescription: 5-Pin Through Hole Terminal Package, Body 28 x 5 mm; Packing: Tube, Case; DatasheetVersion: 201402-T; Mounting Technology: Through Hole; PackageVersion: ASCTB205E, 02/2014; ComponentLink2URL: http://www3.panasonic.biz/ac/e_download/control/relay/power/catalog/mech_eng_pf.pdf?f_cd=300412
TP4 = CMP-1672-00003-4: Test Point, Black, Through Hole, RoHS, Bulk; Manufacturer: Keystone; Body Material: PBT; Gender: Female; Number of Ports: 1; Inside Diameter: 1.78mm; Hole Diameter: 1.6mm; ComponentLink2URL: http://www.keyelco.com/product-pdf.cfm?p=1320; Colour: Black; Pins: 1; REACH SVHC: No SVHC; ComponentLink1URL: http://www.keyelco.com/; PackageReference: 5011; Contact Plating: Silver; Package Quantity: 100; Packaging: Bulk; RoHSCompliant: true; Height: 8.12 mm; PackageDescription: 1-Pin Through Hole Device, Dia 3.17 mm; Mount: Through Hole; Mounting Technology: Through Hole; DatasheetVersion: Rev. F, 12/2013; ComponentLink1Description: Manufacturer URL; Contact Material: Bronze; ComponentLink2Description: Datasheet; Supplier 1: Mouser; Supplier Part Number 1: 534-5011; Manufacturer Part Number: 5011; Stock 1: 63090; Pricing 1: 1=0.53, 10=0.53, 50=0.53, 100=0.371, 1000=0.165, 10000=0.106 (USD); Case/Package: 125; Housing Colour: Black; Material: Bronze,Silver,Nylon; Orientation: Straight; Length: 11.3mm; Lead Free: Lead Free; ComponentLink3URL: https://datasheet.ciiva.com/1454/1718230-1454834.pdf; ComponentLink3Description: https://datasheet.ciiva.com/1454/1718230-1454834.pdf; ComponentLink4URL: https://datasheet.ciiva.com/2917/5011-2917635.pdf; ComponentLink4Description: https://datasheet.ciiva.com/2917/5011-2917635.pdf; ComponentLink5URL: https://datasheet.ciiva.com/16351/m60-2p60-16351093.pdf; ComponentLink5Description: https://datasheet.ciiva.com/16351/m60-2p60-16351093.pdf; ComponentLink6URL: https://datasheet.ciiva.com/11744/0900766b8009b7c7-11744935.pdf; ComponentLink6Description: https://datasheet.ciiva.com/11744/0900766b8009b7c7-11744935.pdf; ComponentLink7URL: https://datasheet.ciiva.com/46412/1703983-46412138.pdf; ComponentLink7Description: https://datasheet.ciiva.com/46412/1703983-46412138.pdf
U1 = CMP-0491-01698-1: IC REG BOOST ADJ 0.3A TSOT23-6; Manufacturer 1: Linear Technology; Manufacturer Part Number 1: LT3461AES6#TRMPBF; Category 1: Integrated Circuits (ICs); Function: Step-Up; Output Configuration: Positive; Output Type: Adjustable; Number of Outputs: 1; Voltage - Input (Min): 2.5V; Voltage - Input (Max): 16V; Voltage - Output (Min/Fixed): 1.255V; Voltage - Output (Max): 38V; Current - Output: 300mA (Switch); Frequency - Switching: 3MHz; Synchronous Rectifier: No; Supplier 1: Digi-Key; Supplier Part Number 1: LT3461AES6#TRMPBFCT-ND; RoHS 1: RoHS Compliant; Description 1: IC REG BOOST ADJ 0.3A TSOT23-6; Stock 1: 1325; Pricing 1: 1=3.94, 25=3.52, 100=2.4, 250=2.2 (USD); Packaging: Cut Tape (CT); Part Status: Active; Topology: Boost; Operating Temperature: 0°C ~ 70°C (TA); Mounting Type: Surface Mount; Package / Case: SOT-23-6 Thin, TSOT-23-6; Supplier Device Package: TSOT-23-6; ComponentLink1URL: http://www.linear.com/docs/3469; ComponentLink1Description: http://www.linear.com/docs/3469
U2 = BD90GA3WEFJ-E2: IC REG LDO 9V 0.3A 8HTSOP-J; Manufacturer: Rohm Semiconductor; Regulator Topology: Positive Fixed; Current - Output: 300mA; Voltage - Dropout (Typical): 0.6V @ 300mA; Voltage - Input: Up to 14V; Supplier 1: Digi-Key; Supplier Part Number 1: BD90GA3WEFJ-E2CT-ND; Manufacturer Part Number: BD90GA3WEFJ-E2; RoHS: RoHS Compliant; Category: Integrated Circuits (ICs); Stock 1: 4781; Pricing 1: 1=0.69, 10=0.606, 25=0.5364, 100=0.4672, 250=0.40664, 500=0.34608, 1000=0.27686 (USD); Packaging: Cut Tape (CT); Part Status: Active; Voltage - Output: 9V; Current - Limit (Min): -; Operating Temperature: -25°C ~ 85°C; Mounting Type: Surface Mount; Package / Case: 8-SOIC (0.154", 3.90mm Width) Exposed Pad; Supplier Device Package: 8-HTSOP-J; ComponentLink1URL: http://rohmfs.rohm.com/en/products/databook/datasheet/ic/power/linear_regulator/bdxxga3wefj-e.pdf; ComponentLink1Description: http://rohmfs.rohm.com/en/products/databook/datasheet/ic/power/linear_regulator/bdxxga3wefj-e.pdf
U3 = CCG302412S: IC CONV DC-DC 15W DUAL 5V PCB; Manufacturer 1: TDK-Lambda Americas Inc.; Category 1: Power Supplies - Board Mount; Number of Outputs: 2; Voltage - Input (Min): 9V; Voltage - Input (Max): 36V; Voltage - Output 2: -5V; Current - Output (Max): 1.5A, 1.5A; Voltage - Isolation: 1.6kV (1600V); Efficiency: 85%; Supplier 1: Digi-Key; Supplier Part Number 1: 285-1902-ND; Manufacturer Part Number 1: PXB15-24WD05/N; RoHS 1: RoHS Compliant; Description 1: IC CONV DC-DC 15W DUAL 5V PCB; Stock 1: 28; Pricing 1: 1=61.61, 10=59.59 (USD); Packaging: Tube; Part Status: Active; Type: Isolated Module; Voltage - Output 1: 5V; Voltage - Output 3: -; Power (Watts): 15W; Applications: ITE (Commercial); Features: Remote On/Off, OCP, OVP, SCP; Operating Temperature: -40°C ~ 85°C; Mounting Type: Through Hole; Package / Case: 6-DIP Module; Size / Dimension: 1.00" L x 1.00" W x 0.39" H (25.4mm x 25.4mm x 9.9mm); ComponentLink1URL: http://us.tdk-lambda.com/ftp/AppNotes/pxb15w-d_appnote.pdf; ComponentLink1Description: http://us.tdk-lambda.com/ftp/AppNotes/pxb15w-d_appnote.pdf
U4 = CMP-0476-01685-1: 500 mA, Low Noise, LDO Micropower Regulator, 1.8 to 20 V Vin, 5 V Vout, 8-pin SOIC (S8-8), -40 to 125 degC, Pb-Free; Manufacturer: Linear Technology; Output Voltage: 5 V; Vin Min(V): 1.8; Discrete Pass Element: no; Number of Outputs: 1; Dropout Voltage(V): 0.3; Vin Max(V): 20; PSRR(dB): 65; Iout(mA): 500; Isupply(mA): 0.03; Mounting Technology: Surface Mount; ComponentLink3Description: Package Specification; PartNumber: LT1763CS8-5#PBF; PackageDescription: 8-Pin Plastic Small Outline (Narrow .150 Inch), Body 4.9 x 3.9 mm, Pitch 1.27 mm; DatasheetVersion: Rev. G; ComponentLink2URL: http://cds.linear.com/docs/en/datasheet/1763fg.pdf; PackageReference: S8-8; ComponentLink1URL: http://www.linear.com/; ComponentLink2Description: Datasheet; ComponentLink1Description: Manufacturer URL; PackageVersion: Rev. G, 03/2012; Shutdown Current(uA): 1; ComponentLink3URL: http://cds.linear.com/docs/en/packaging/05081610_G_SO8.pdf; RoHS: TRUE; Noise(uV): 20
U5 = CMP-1310-00373-1: Low Voltage, Rail-to-Rail Output Operational Amplifier, 1.7 to 5.5 V, -40 to 85 degC, 5-Pin SOT-553, Pb-Free, Tape and Reel; Manufacturer: On Semiconductor; VCC Min (V): 1.7; VCC Max (V): 5.5; ComponentLink1Description: Manufacturer URL; Mounting Technology: Surface Mount; ComponentLink1URL: http://www.onsemi.com/; Packing: Tape and Reel; PackageReference: SOT-553-5-463B; PartNumber: NCS2003XV53T2G; PackageDescription: 5-Pin Small Outline Transistor, Body 1.6 x 1.2 mm, Pitch 0.5 mm; PackageVersion: Rev. C, 03/2013; RoHS: TRUE; ComponentLink2URL: http://www.onsemi.cn/pub_link/Collateral/NCS2003-D.PDF; ComponentLink3URL: http://www.onsemi.com/pub_link/Collateral/463B-01.PDF; ComponentLink3Description: Package Specification; DatasheetVersion: Rev. 3; ComponentLink2Description: Datasheet
U6 = CCG302412S: DC/DC CONVERTER 12V 2.5A PCB; Power (Watts) - Manufacture Series: 30W; Manufacturer 1: TDK-Lambda Americas Inc; Number of Outputs: 1; Voltage - Input (Min): 9V; Voltage - Input (Max): 36V; Voltage - Isolation: 1.5kV (1500V); Efficiency: 89%; Category 1: Power Supplies - Board Mount; Packaging: Tube; Type: Isolated Module; Voltage - Output 1: 12V; Voltage - Output 2: -; Voltage - Output 3: -; Current - Output (Max): 2.5A; Features: Remote On/Off, OCP; Mounting Type: Through Hole; Package / Case: 6-DIP Module (6 Leads); Size / Dimension: 1.00" L x 1.00" W x 0.39" H (25.4mm x 25.4mm x 9.9mm); Operating Temperature: -40°C ~ 85°C; Power (Watts) - Max: 30W; ComponentLink1URL: http://www.us.tdk-lambda.com/ftp/specs/ccg30.pdf; ComponentLink1Description: http://www.us.tdk-lambda.com/ftp/specs/ccg30.pdf; Supplier 1: Digi-Key; Supplier Part Number 1: 285-2419-ND; Manufacturer Part Number 1: CCG302412S; RoHS 1: RoHS Compliant; Description 1: DC/DC CONVERTER 12V 2.5A PCB; Stock 1: 30; Pricing 1: 1=43.63, 10=42.95 (USD)